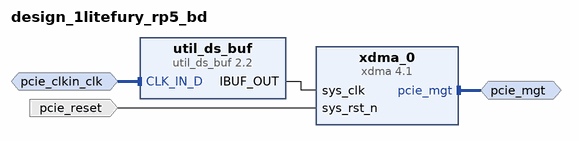
[diagram p0: block diagram of the top level]
# Vivado block design design_1litefury_rp5_bd, xc7a100tfgg484-2, Vivado 2023.2
create_bd_design design_1litefury_rp5_bd

create_bd_intf_port -mode Master -vlnv xilinx.com:interface:pcie_7x_mgt_rtl:1.0 pcie_mgt
create_bd_intf_port -mode Slave -vlnv xilinx.com:interface:diff_clock_rtl:1.0 pcie_clkin_clk
set_property -dict {CONFIG.FREQ_HZ 100000000} [get_bd_intf_ports pcie_clkin_clk]
create_bd_port -dir I -type rst pcie_reset
set_property -dict {CONFIG.POLARITY ACTIVE_LOW} [get_bd_ports pcie_reset]

create_bd_cell -type ip -vlnv xilinx.com:ip:xdma:4.1 xdma_0
set_property -dict [list \
  CONFIG.axi_data_width 64_bit \
  CONFIG.axilite_master_en true \
  CONFIG.axisten_freq 125 \
  CONFIG.pl_link_cap_max_link_speed 5.0_GT/s \
  CONFIG.xdma_axi_intf_mm AXI_Stream \
] [get_bd_cells xdma_0]
create_bd_cell -type ip -vlnv xilinx.com:ip:util_ds_buf:2.2 util_ds_buf
set_property -dict {CONFIG.C_BUF_TYPE IBUFDSGTE} [get_bd_cells util_ds_buf]

# ---- connections ----

connect_bd_intf_net -intf_net diff_clock_rtl_0_1 [get_bd_intf_ports pcie_clkin_clk] [get_bd_intf_pins util_ds_buf/CLK_IN_D]
connect_bd_intf_net [get_bd_intf_ports pcie_mgt] [get_bd_intf_pins xdma_0/pcie_mgt]
connect_bd_net -net reset_rtl_0_1 [get_bd_ports pcie_reset] [get_bd_pins xdma_0/sys_rst_n]
connect_bd_net [get_bd_pins util_ds_buf/IBUF_OUT] [get_bd_pins xdma_0/sys_clk]

validate_bd_design
save_bd_design
